# Altium schematic sheet Main.SchDoc: BikeHUD PCB
size A; Author: Håkon Liverud; DocumentNumber: 1; Revision: 1; SheetNumber: 1; SheetTotal: 1
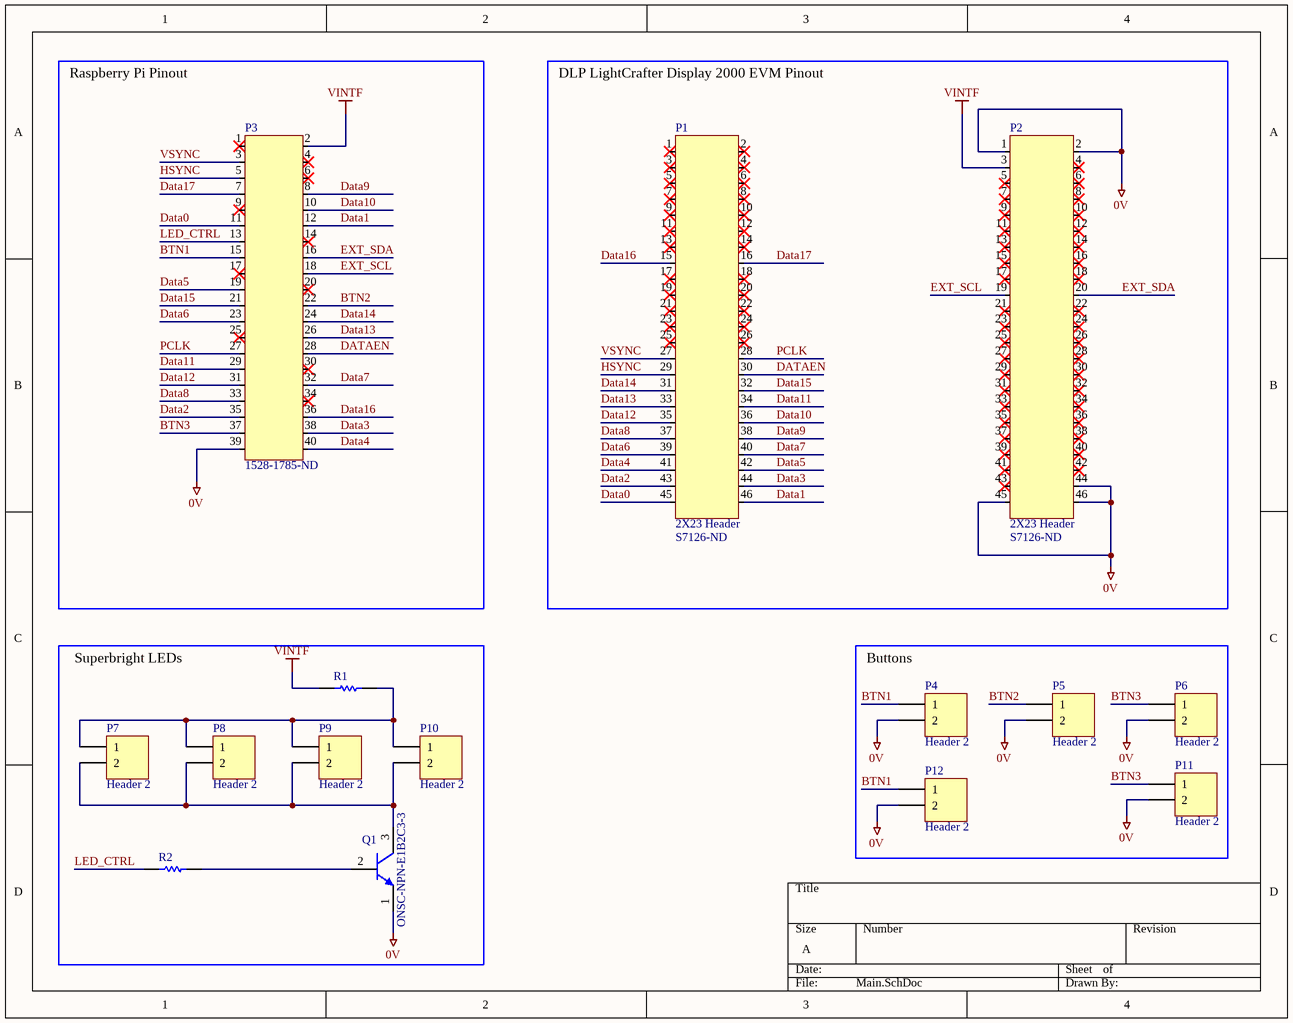
[diagram p0: Main.SchDoc]

## Parts
P1  2X23 Header  Supplier Part Number 1: S7126-ND  [2X23 hEADER]
P2  2X23 Header  Supplier Part Number 1: S7126-ND  [2X23 hEADER]
P3  Supplier Part Number 1: 1528-1785-ND  [2222]  (hidden comment: 2x20 Header)
P4  Header 2  [HDR1X2]
P5  Header 2  [HDR1X2]
P6  Header 2  [HDR1X2]
P7  Header 2  [HDR1X2]
P8  Header 2  [HDR1X2]
P9  Header 2  [HDR1X2]
P10  Header 2  [HDR1X2]
P11  Header 2  [HDR1X2]
P12  Header 2  [HDR1X2]
Q1  ONSC-NPN-E1B2C3-3  [ONSC-TO-92-3-29-11]
R1  Res1  [AXIAL-0.3]  (value not drawn)
R2  Res1  [AXIAL-0.3]  (value not drawn)

## Blocks framed on the sheet
Raspberry Pi Pinout: P3
DLP LightCrafter Display 2000 EVM Pinout: P1 P2
Superbright LEDs: P7-P10 Q1 R1 R2
Buttons: P4-P6 P11 P12

## Nets
0V: P2.1 P2.2 P2.44 P2.45 P2.46 P3.39 P4.2 P5.2 P6.2 P11.2 P12.2 Q1.1(E)
VINTF: P2.3 P3.2 R1.1
BTN1: P3.15 P4.1 P12.1
BTN2: P3.22 P5.1
BTN3: P3.37 P6.1 P11.1
Data0: P1.45 P3.11
Data1: P1.46 P3.12
Data2: P1.43 P3.35
Data3: P1.44 P3.38
Data4: P1.41 P3.40
Data5: P1.42 P3.19
Data6: P1.39 P3.23
Data7: P1.40 P3.32
Data8: P1.37 P3.33
Data9: P1.38 P3.8
Data10: P1.36 P3.10
Data11: P1.34 P3.29
Data12: P1.35 P3.31
Data13: P1.33 P3.26
Data14: P1.31 P3.24
Data15: P1.32 P3.21
Data16: P1.15 P3.36
Data17: P1.16 P3.7
DATAEN: P1.30 P3.28
EXT_SCL: P2.19 P3.18
EXT_SDA: P2.20 P3.16
HSYNC: P1.29 P3.5
LED_CTRL: P3.13 R2.1
PCLK: P1.28 P3.27
VSYNC: P1.27 P3.3
NetP7_1: P7.1 P8.1 P9.1 P10.1 R1.2
NetP7_2: P7.2 P8.2 P9.2 P10.2 Q1.3(C)
NetQ1_2: Q1.2(B) R2.2

Not connected (* = marked no-connect by the designer): P1 1* 2* 3* 4* 5* 6* 7* 8* 9* 10* 11* 12* 13* 14* 17* 18* 19* 20* 21* 22* 23* 24* 25* 26*; P2 4* 5* 6* 7* 8* 9* 10* 11* 12* 13* 14* 15* 16* 17* 18* 21* 22* 23* 24* 25* 26* 27* 28* 29* 30* 31* 32* 33* 34* 35* 36* 37* 38* 39* 40* 41* 42* 43*; P3 1* 4* 6* 9* 14* 17* 20* 25* 30* 34*

## Notes on the sheet
- (near P3) See mapping here: http://frederickvandenbosch.be/?p=2948
- (near R1) Taken from: https://forums.raspberrypi.com/viewtopic.php?t=206387

## Library data of the parts
P1 P2 = PPPC232LFBN-RC: Board Connector, 46 Contact(s), 2 Row(s), Female, Straight, 0.1 inch Pitch, Solder Terminal, Locking; Manufacturer: Sullins; Manufacturer Series: PP; Contact Pattern: RECTANGULAR; Contact Style: SQ PIN-SKT; Number Of Connectors: 1; Number Of PCB Rows: 2; Polarization Key: POLARIZED HOUSING; Rated Current (Signal): 3A; Number of Contacts: 46; Body Breadth: 0.197inch; Body Depth: 0.334inch; Body Length: 2.32inch; PCB Contact Row Spacing: 2.54mm; Reference Standard: UL; Reliability: COMMERCIAL; Supplier 1: Digi-Key; Manufacturer Part Number: PPPC232LFBN-RC; RoHS: Yes; Category: Connectors; Stock 1: 3254; Pricing 1: 1=2,43000, 10=2,20600, 80=1,94400, 440=1,65241, 1000=1,40940, 5000=1,40400 (USD); Mount: Board; Contact Material: Bronze; Contact Finish - Mating: AU; Insulation Material: Polyester; Connector Type: BOARD CONNECTOR; Contact Gender: Female; Mounting Style: STRAIGHT; Number of Rows Loaded: 2; PCB Contact Pattern: RECTANGULAR; Termination: Solder; Mating Contact Pitch: 0.1inch; Mating Contact Row Spacing: 0.1inch; Mounting Option 1: LOCKING; Terminal Length: 0.125inch; Terminal Pitch: 2.54mm; REACH SVHC: Yes; RoHS Compliant: Yes; ComponentLink1URL: https://datasheet.ciiva.com:443/pdfs/VipMasterIC/IC/SUCS/SUCSS00270/SUCSS00270-1.pdf?src-supplier=IHS+Markit; ComponentLink1Description: https://datasheet.ciiva.com:443/pdfs/VipMasterIC/IC/SUCS/SUCSS00270/SUCSS00270-1.pdf?src-supplier=IHS+Markit; ComponentLink2URL: https://media.digikey.com/pdf/Data%20Sheets/Sullins%20PDFs/Female_Headers.100_DS.pdf?src-supplier=Digi-Key; ComponentLink2Description: https://media.digikey.com/pdf/Data%20Sheets/Sullins%20PDFs/Female_Headers.100_DS.pdf?src-supplier=Digi-Key
P3 = 2222: GPIO FEMALE HEADER RASPBERRY PI; Manufacturer: Adafruit Industries; Supplier 1: Digi-Key; Manufacturer Part Number: 2222; RoHS: No; Stock 1: 1603; Pricing 1: 1=1,50000 (USD); ComponentLink1URL: https://cdn-shop.adafruit.com/product-files/2222/00587.pdf?src-supplier=Digi-Key; ComponentLink1Description: https://cdn-shop.adafruit.com/product-files/2222/00587.pdf?src-supplier=Digi-Key
P4-P12 = Header 2: Header, 2-Pin; LatestRevisionDate: 17-Jul-2002; LatestRevisionNote: Re-released for DXP Platform.; Publisher: Altium Limited
R1 R2 = Res1: Resistor; Published: 8-Jun-2000; LatestRevisionDate: 17-Jul-2002; LatestRevisionNote: Re-released for DXP Platform.; PackageReference: AXIAL-0.3; Publisher: Altium Limited; PackageDescription: Axial Device, Thru-Hole; 2 Leads; 0.3 in Pin Spacing